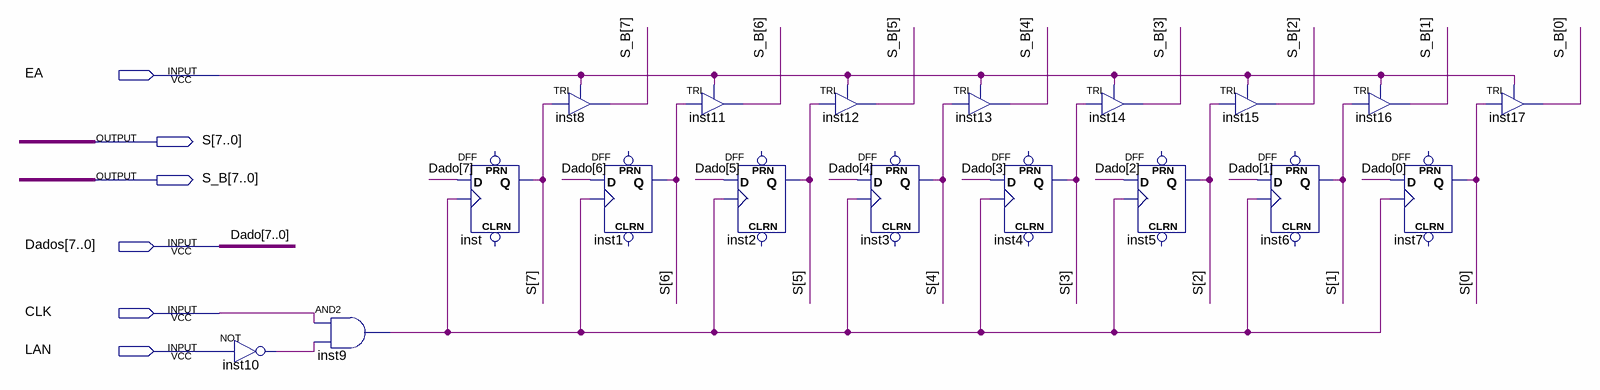
[diagram p0: schematic sheet]
// Quartus schematic Acumulador.bdf as structural Verilog: 18 symbols, 6 pins
module Acumulador (
  input  EA,
  input  [7:0] Dados,
  input  CLK,
  input  LAN,
  output [7:0] S,
  output [7:0] S_B
);

  wire inst9_out, inst10_out;

  not inst10 (inst10_out, LAN);
  and inst9 (inst9_out, CLK, inst10_out);
  DFF inst (.CLK(inst9_out), .D(Dados[7]), .Q(S[7]));  // open: CLRN, PRN
  TRI inst8 (.IN(S[7]), .OE(EA), .OUT(S_B[7]));
  DFF inst1 (.CLK(inst9_out), .D(Dados[6]), .Q(S[6]));  // open: CLRN, PRN
  TRI inst11 (.IN(S[6]), .OE(EA), .OUT(S_B[6]));
  DFF inst2 (.CLK(inst9_out), .D(Dados[5]), .Q(S[5]));  // open: CLRN, PRN
  TRI inst12 (.IN(S[5]), .OE(EA), .OUT(S_B[5]));
  DFF inst3 (.CLK(inst9_out), .D(Dados[4]), .Q(S[4]));  // open: CLRN, PRN
  TRI inst13 (.IN(S[4]), .OE(EA), .OUT(S_B[4]));
  DFF inst4 (.CLK(inst9_out), .D(Dados[3]), .Q(S[3]));  // open: CLRN, PRN
  TRI inst14 (.IN(S[3]), .OE(EA), .OUT(S_B[3]));
  DFF inst5 (.CLK(inst9_out), .D(Dados[2]), .Q(S[2]));  // open: CLRN, PRN
  TRI inst15 (.IN(S[2]), .OE(EA), .OUT(S_B[2]));
  DFF inst6 (.CLK(inst9_out), .D(Dados[1]), .Q(S[1]));  // open: CLRN, PRN
  TRI inst16 (.IN(S[1]), .OE(EA), .OUT(S_B[1]));
  DFF inst7 (.CLK(inst9_out), .D(Dados[0]), .Q(S[0]));  // open: CLRN, PRN
  TRI inst17 (.IN(S[0]), .OE(EA), .OUT(S_B[0]));

  // Other names for the same wires on the sheet: Dado[7:0] = Dados
endmodule
